# Altium schematic sheet NTC Measurement.SchDoc: NTC Measurement
size 152 x 127 mm; Author: Arjan Blankestijn; Revision: V1; SheetNumber: 3; SheetTotal: 3; Team: 2024; ProjectPrettyName: BMS; Subsystem: Module Board
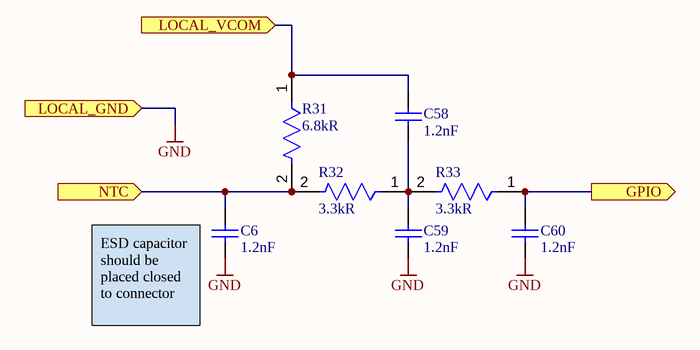
[diagram p0: NTC Measurement.SchDoc]

## Parts
C6  value 1.2nF  [WCAP-CSGP_0402_L1W0.5H0.5]  (hidden comment: 1.2nF 0402 C_NTC)
C58  value 1.2nF  [WCAP-CSGP_0402_L1W0.5H0.5]  (hidden comment: 1.2nF 0402 C_NTC)
C59  value 1.2nF  [WCAP-CSGP_0402_L1W0.5H0.5]  (hidden comment: 1.2nF 0402 C_NTC)
C60  value 1.2nF  [WCAP-CSGP_0402_L1W0.5H0.5]  (hidden comment: 1.2nF 0402 C_NTC)
R31  Resistance: 6.8kR  [FP-RT0402-0_35-MFG]  (hidden comment: 6.8kR 0402 0.1%)
R32  Resistance: 3.3kR  [FP-RT0402-0_35-MFG]  (hidden comment: 3.3R 0402 0.1%)
R33  Resistance: 3.3kR  [FP-RT0402-0_35-MFG]  (hidden comment: 3.3R 0402 0.1%)

## Ports
GPIO (out), LOCAL_GND (in), LOCAL_VCOM (in), NTC (in)

## Nets
GND: C6.1 C59.1 C60.1 ; port LOCAL_GND
GPIO: C60.2 R33.1 ; port GPIO
LOCAL_VCOM: C58.2 R31.1 ; port LOCAL_VCOM
NTC: C6.2 R31.2 R32.2 ; port NTC
NetC58_1: C58.1 C59.2 R32.1 R33.2

## Notes on the sheet
- (near C6) ESD capacitor should be placed closed to connector
- Team
- Authors
- Revision
- Title
- Project
- Subsystem
- File
- Sheet
- //

## Library data of the parts
C6 C58-C60 = CMP-001-00864-1: WCAP-CSGP Multilayer Ceramic Chip Capacitor, General Purpose, size 0402, X7R, 1.2nF, 50VDC; Manufacturer Part Number: 885012205092; Manufacturer: Wurth Elektronik; Dissipation Factor: 10%; Technical Reference: X7R0402104J050DFCT10000; Rated Voltage (DC): 50V; Capacitance Tolerance: +/-5%; Insulation Resistance: 0.5GO; Ceramic Type: X7R; Design Item ID: 885012205092; Operating Temperature Max: 125°C; Width: 0.5mm; ComponentLink2URL: https://www.we-online.com/redexpert/spec/885012205092?ad; Match Code: WCAP-CSGP; Mount: Surface Mount; ComponentLink1Description: Website Link; Height: 0.5mm; Component Type: Standard; Category: Multilayer Ceramic Chip Capacitors; ComponentLink1URL: https://www.we-online.com/redexpert/article/885012205092?ad; Source: WCAP-CSGP.SchLib; Packaging: Tape and Reel; Pins: 2; ComponentLink2Description: Datasheet Link; Operating Temperature Min: -55°C; Length: 1mm; Case/Package: 0402
R31 = CMP-2002-02972-3: RES SMD 6K8 OHM 0.1% 1/16W 0402; Temperature Coefficient: 50ppm/°C; Voltage Rating (DC): 50V; Max Power Dissipation: 63mW; Number of Terminations: 2; Construction: Rectangular; Series: RT; Length: 0.039inch; Case Code (Metric): 1005; Military Standard: Not; Height: 0.014inch; Features: Moisture Resistant; Package Quantity: 10000; Case/Package: 0402; Lead Free: Lead Free; Width: 0.02inch; RoHS Compliant: Yes; Tolerance: 0.1%; Case Code (Imperial): 0402; Size Code: 0402; Depth: 0.5mm; Min Operating Temperature: -55°C; Max Operating Temperature: 155°C; Resistor Type: Thin Film; Power Rating: 63mW; Packaging: Tape and Reel
R32 R33 = CMP-2002-02972-3: RES SMD 3K3 OHM 0.1% 1/16W 0402; Temperature Coefficient: 50ppm/°C; Voltage Rating (DC): 50V; Max Power Dissipation: 63mW; Number of Terminations: 2; Construction: Rectangular; Series: RT; Length: 0.039inch; Case Code (Metric): 1005; Military Standard: Not; Height: 0.014inch; Features: Moisture Resistant; Package Quantity: 10000; Case/Package: 0402; Lead Free: Lead Free; Width: 0.02inch; RoHS Compliant: Yes; Tolerance: 0.1%; Case Code (Imperial): 0402; Size Code: 0402; Depth: 0.5mm; Min Operating Temperature: -55°C; Max Operating Temperature: 155°C; Resistor Type: Thin Film; Power Rating: 63mW; Packaging: Tape and Reel